# Altium project FD-JUL-MB.PrjPcb (part 1 of 3)
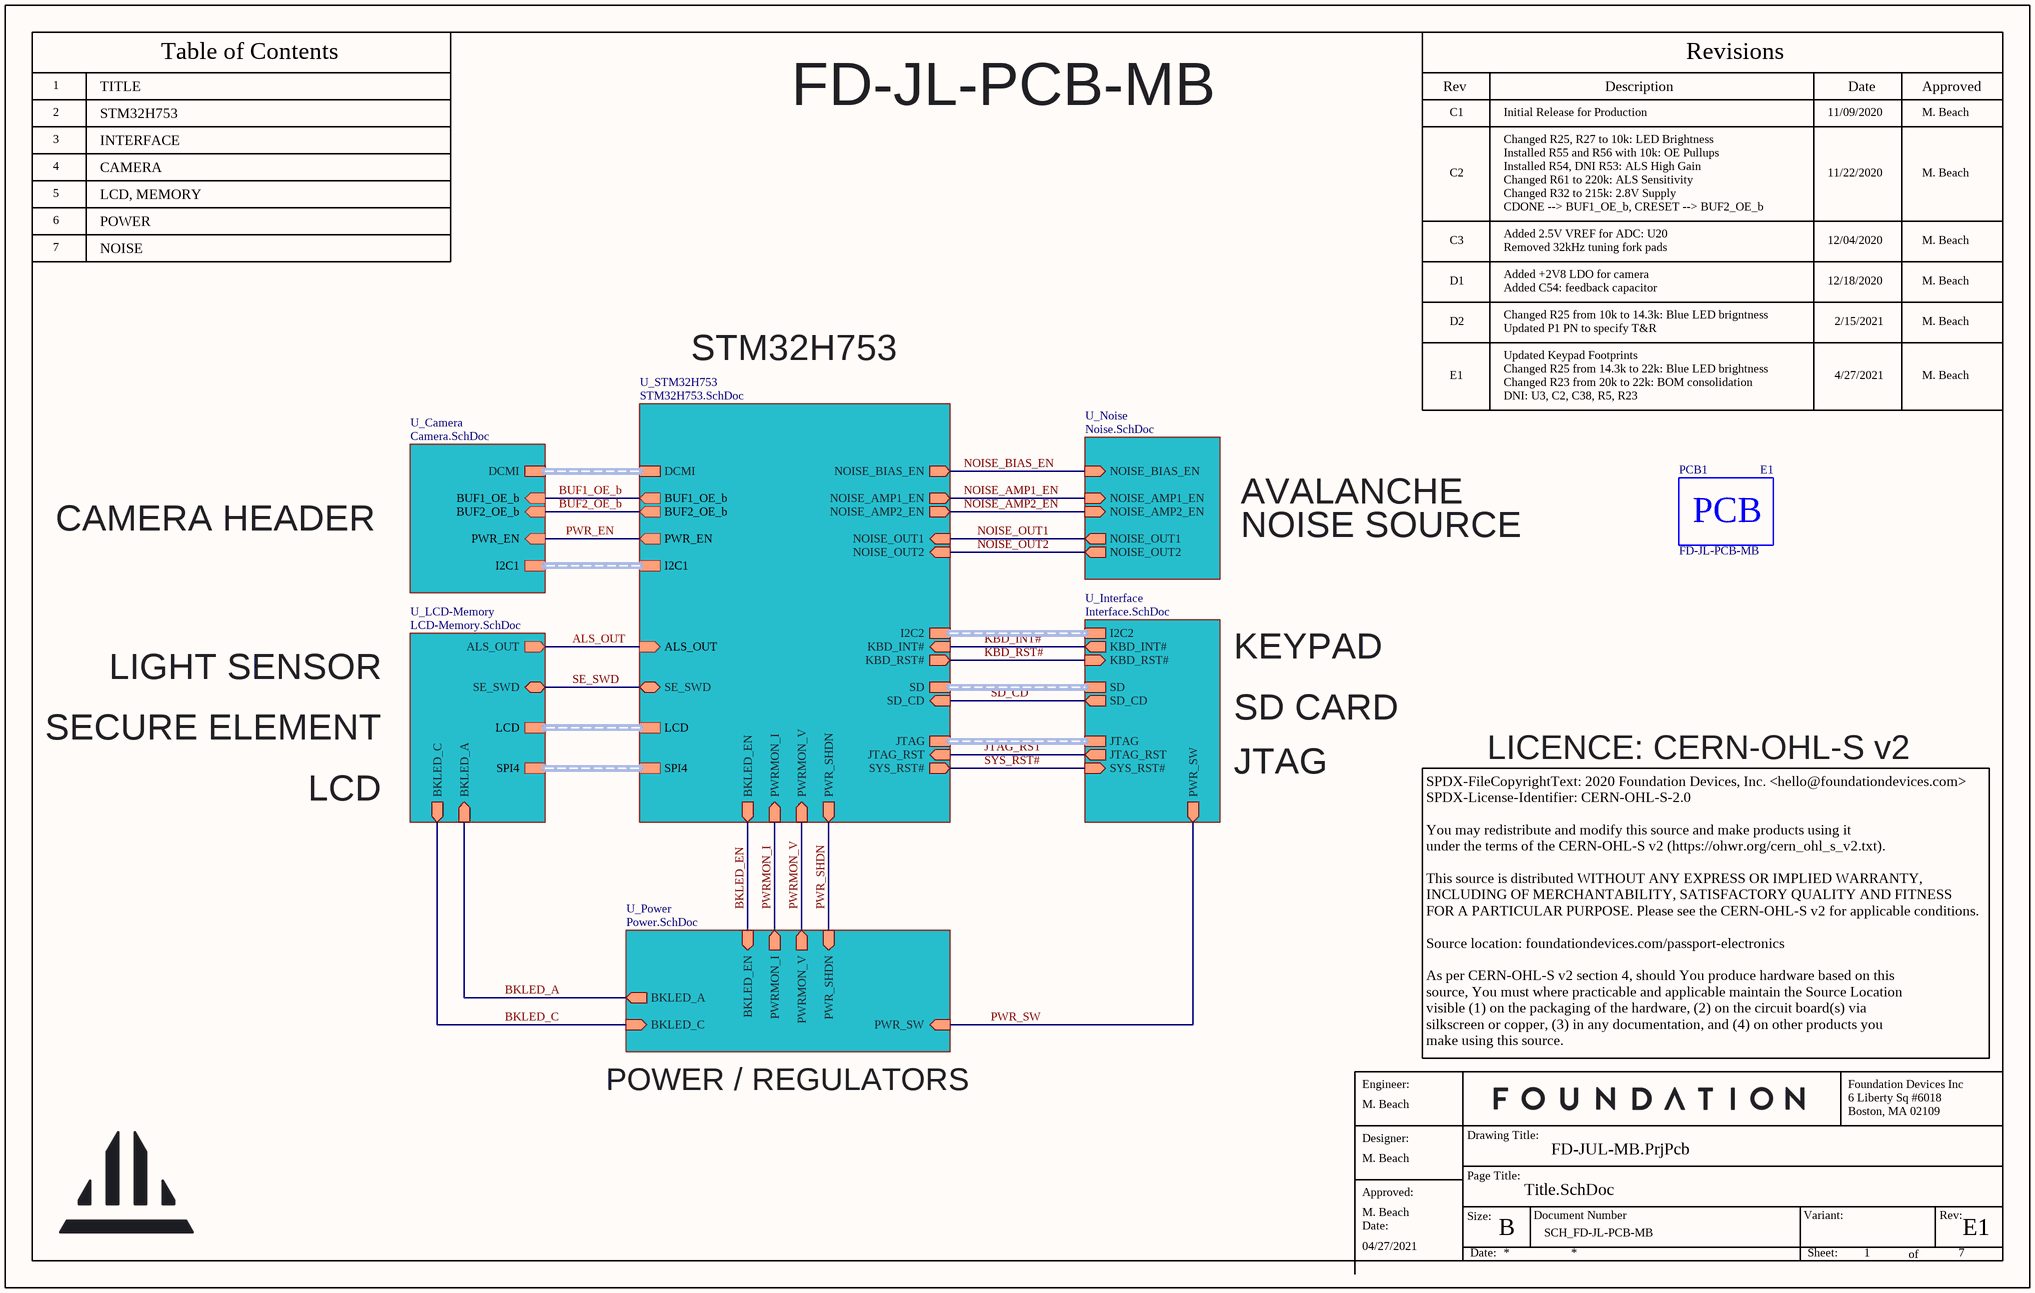
[diagram p0: Title.SchDoc]
SCH_REV: E1; PCB_REV: E1; PCB_PART_NUMBER: FD-JL-PCB-MB; PCB_ENGINEER_APP_DATE: 04/27/2021; PCB_ENGINEER: M. Beach; PCB_DWG_NO: PCB-DWG_FD-JL-PCB-MB; PCB_DESIGNER_APP_DATE: 04/27/2021; PCB_DESIGNER: M. Beach; PCB_CHECKER_APP_DATE: 04/27/2021; PCB_CHECKER: M. Beach; PCB_ASSEMBLY_NO: PCB-ASSY_FD-JL-PCB-MB; PCB_ANG_TOL: +/-1/2; PCB_3_DEC_TOL: +/-.010; PCB_2_DEC_TOL: +/-.01; NotFitted: NF; DOC_NO_SCH_DWG: SCH_FD-JL-PCB-MB; DOC_NO_FAB_DWG: FAB_FD-JL-PCB-MB; DOC_NO_BOM: BOM_FD-JL-PCBA-MB; DOC_NO_ASSY_DWG: ASSY_FD-JL-PCBA-MB
7 sheets, 215 parts. Net scope: hierarchical (ports join the sheet entries above them; power ports are global).
Board file: FD-JUL-MB_PCB.PcbDoc
Sheets:
  Title.SchDoc
    U_STM32H753 = STM32H753.SchDoc
    U_LCD-Memory = LCD-Memory.SchDoc
    U_Interface = Interface.SchDoc
    U_Power = Power.SchDoc
    U_Camera = Camera.SchDoc
    U_Noise = Noise.SchDoc

## Sheet Title.SchDoc
size B; DocumentNumber: 1; SheetNumber: 1; SheetTotal: 7; ENG_APP_DATE: --/--/--; DSN_APP_DATE: --/--/--; CHK_APP_DATE: --/--/--

### Parts
PCB1  FD-JL-PCB-MB  Rev: E1  (mechanical)

### Sub-sheets
U_Camera = Camera.SchDoc: DCMI (harness DCMI), BUF2_OE_b (in), PWR_EN (in), BUF1_OE_b (in), I2C1 (harness I2C)
U_Interface = Interface.SchDoc: I2C2 (harness I2C), KBD_INT# (out), SD (harness SD_Card), JTAG (harness JTAG), KBD_RST# (in), SD_CD (out), JTAG_RST (out), PWR_SW (out), SYS_RST# (in)
U_LCD-Memory = LCD-Memory.SchDoc: BKLED_A (in), BKLED_C (out), SE_SWD (bidir), ALS_OUT (out), LCD (harness LCD), SPI4 (harness SPI)
U_Noise = Noise.SchDoc: NOISE_OUT1 (out), NOISE_AMP2_EN (in), NOISE_BIAS_EN (in), NOISE_OUT2 (out), NOISE_AMP1_EN (in)
U_Power = Power.SchDoc: BKLED_A (out), BKLED_C (in), BKLED_EN (in), PWR_SHDN (in), PWR_SW (in), PWRMON_I (out), PWRMON_V (out)
U_STM32H753 = STM32H753.SchDoc: SD (harness SD_Card), KBD_INT# (in), I2C2 (harness I2C), JTAG (harness JTAG), DCMI (harness DCMI), KBD_RST# (out), SE_SWD (bidir), BKLED_EN (out), SD_CD (in), JTAG_RST (in), PWR_SHDN (out), SYS_RST# (out), NOISE_BIAS_EN (out), NOISE_AMP1_EN (out), NOISE_AMP2_EN (out), NOISE_OUT1 (in), NOISE_OUT2 (in), PWRMON_I (in), PWRMON_V (in), BUF2_OE_b (out), PWR_EN (out), BUF1_OE_b (out), LCD (harness LCD), I2C1 (harness I2C), SPI4 (harness SPI), ALS_OUT (in)

### Nets
ALS_OUT: sheet U_STM32H753/ALS_OUT, sheet U_LCD-Memory/ALS_OUT
BKLED_A: sheet U_LCD-Memory/BKLED_A, sheet U_Power/BKLED_A
BKLED_C: sheet U_LCD-Memory/BKLED_C, sheet U_Power/BKLED_C
BKLED_EN: sheet U_STM32H753/BKLED_EN, sheet U_Power/BKLED_EN
BUF1_OE_b: sheet U_STM32H753/BUF1_OE_b, sheet U_Camera/BUF1_OE_b
BUF2_OE_b: sheet U_STM32H753/BUF2_OE_b, sheet U_Camera/BUF2_OE_b
JTAG_RST: sheet U_STM32H753/JTAG_RST, sheet U_Interface/JTAG_RST
KBD_INT#: sheet U_STM32H753/KBD_INT#, sheet U_Interface/KBD_INT#
KBD_RST#: sheet U_STM32H753/KBD_RST#, sheet U_Interface/KBD_RST#
NOISE_AMP1_EN: sheet U_STM32H753/NOISE_AMP1_EN, sheet U_Noise/NOISE_AMP1_EN
NOISE_AMP2_EN: sheet U_STM32H753/NOISE_AMP2_EN, sheet U_Noise/NOISE_AMP2_EN
NOISE_BIAS_EN: sheet U_STM32H753/NOISE_BIAS_EN, sheet U_Noise/NOISE_BIAS_EN
NOISE_OUT1: sheet U_STM32H753/NOISE_OUT1, sheet U_Noise/NOISE_OUT1
NOISE_OUT2: sheet U_STM32H753/NOISE_OUT2, sheet U_Noise/NOISE_OUT2
PWR_EN: sheet U_STM32H753/PWR_EN, sheet U_Camera/PWR_EN
PWR_SHDN: sheet U_STM32H753/PWR_SHDN, sheet U_Power/PWR_SHDN
PWR_SW: sheet U_Interface/PWR_SW, sheet U_Power/PWR_SW
PWRMON_I: sheet U_STM32H753/PWRMON_I, sheet U_Power/PWRMON_I
PWRMON_V: sheet U_STM32H753/PWRMON_V, sheet U_Power/PWRMON_V
SD_CD: sheet U_STM32H753/SD_CD, sheet U_Interface/SD_CD
SE_SWD: sheet U_STM32H753/SE_SWD, sheet U_LCD-Memory/SE_SWD
SYS_RST#: sheet U_STM32H753/SYS_RST#, sheet U_Interface/SYS_RST#

### Buses and harness runs
harness sheet U_Camera/DCMI = sheet U_STM32H753/DCMI
harness sheet U_Camera/I2C1 = sheet U_STM32H753/I2C1
harness sheet U_Interface/I2C2 = sheet U_STM32H753/I2C2
harness sheet U_Interface/JTAG = sheet U_STM32H753/JTAG
harness sheet U_Interface/SD = sheet U_STM32H753/SD
harness sheet U_LCD-Memory/LCD = sheet U_STM32H753/LCD
harness sheet U_LCD-Memory/SPI4 = sheet U_STM32H753/SPI4

### Notes on the sheet
- TITLE
- 2
- 3
- STM32H753
- INTERFACE
- CAMERA
- FD-JL-PCB-MB
- C1
- Initial Release for Production
- Changed R25, R27 to 10k: LED Brightness
- Installed R55 and R56 with 10k: OE Pullups
- 11/09/2020
- M. Beach
- 4
- 5
- 6
- LCD, MEMORY
- POWER
- C2
- CDONE --> BUF1_OE_b, CRESET --> BUF2_OE_b
- Installed R54, DNI R53: ALS High Gain
- Changed R61 to 220k: ALS Sensitivity
- Changed R32 to 215k: 2.8V Supply
- Added 2.5V VREF for ADC: U20
- 11/22/2020
- 7
- NOISE
- C3
- D1
- Removed 32kHz tuning fork pads
- Added +2V8 LDO for camera
- Added C54: feedback capacitor
- 12/04/2020
- 12/18/2020
- D2
- Changed R25 from 10k to 14.3k: Blue LED brigntness
- Updated P1 PN to specify T&R
- Updated Keypad Footprints
- Changed R25 from 14.3k to 22k: Blue LED brightness
- 2/15/2021
- E1
- DNI: U3, C2, C38, R5, R23
- Changed R23 from 20k to 22k: BOM consolidation
- 4/27/2021
- AVALANCHE
- CAMERA HEADER
- NOISE SOURCE
- KEYPAD
- LIGHT SENSOR
- SD CARD
- SECURE ELEMENT
- JTAG
- LICENCE: CERN-OHL-S v2
- LCD
- POWER / REGULATORS
- SPDX-FileCopyrightText: 2020 Foundation Devices, Inc. <hello@foundationdevices.com>
  SPDX-License-Identifier: CERN-OHL-S-2.0
  You may redistribute and modify this source and make products using it
  under the terms of the CERN-OHL-S v2 (https://ohwr.org/cern_ohl_s_v2.txt).
  This source is distributed WITHOUT ANY EXPRESS OR IMPLIED WARRANTY,
  INCLUDING OF MERCHANTABILITY, SATISFACTORY QUALITY AND FITNESS
  FOR A PARTICULAR PURPOSE. Please see the CERN-OHL-S v2 for applicable conditions.
  Source location: foundationdevices.com/passport-electronics
  As per CERN-OHL-S v2 section 4, should You produce hardware based on this
  source, You must where practicable and applicable maintain the Source Location
  visible (1) on the packaging of the hardware, (2) on the circuit board(s) via
  silkscreen or copper, (3) in any documentation, and (4) on other products you
  make using this source.
- 1
- Table of Contents
- Rev
- Description
- Revisions
- Date
- Approved
- Engineer:
- Foundation Devices Inc
- 6 Liberty Sq #6018
- Designer:
- Drawing Title:
- Page Title:
- Boston, MA 02109
- Approved:
- Date:
- Size:
- B
- Document Number
- Variant:
- Rev:
- Sheet:
- of

### Library data of the parts
PCB1 = CMP-MISC-00002-5: PCB - Juliet - Main Board

## Sheet STM32H753.SchDoc
size B; DocumentNumber: 2; SheetNumber: 2; SheetTotal: 7; ENG_APP_DATE: --/--/--; DSN_APP_DATE: --/--/--; CHK_APP_DATE: --/--/--
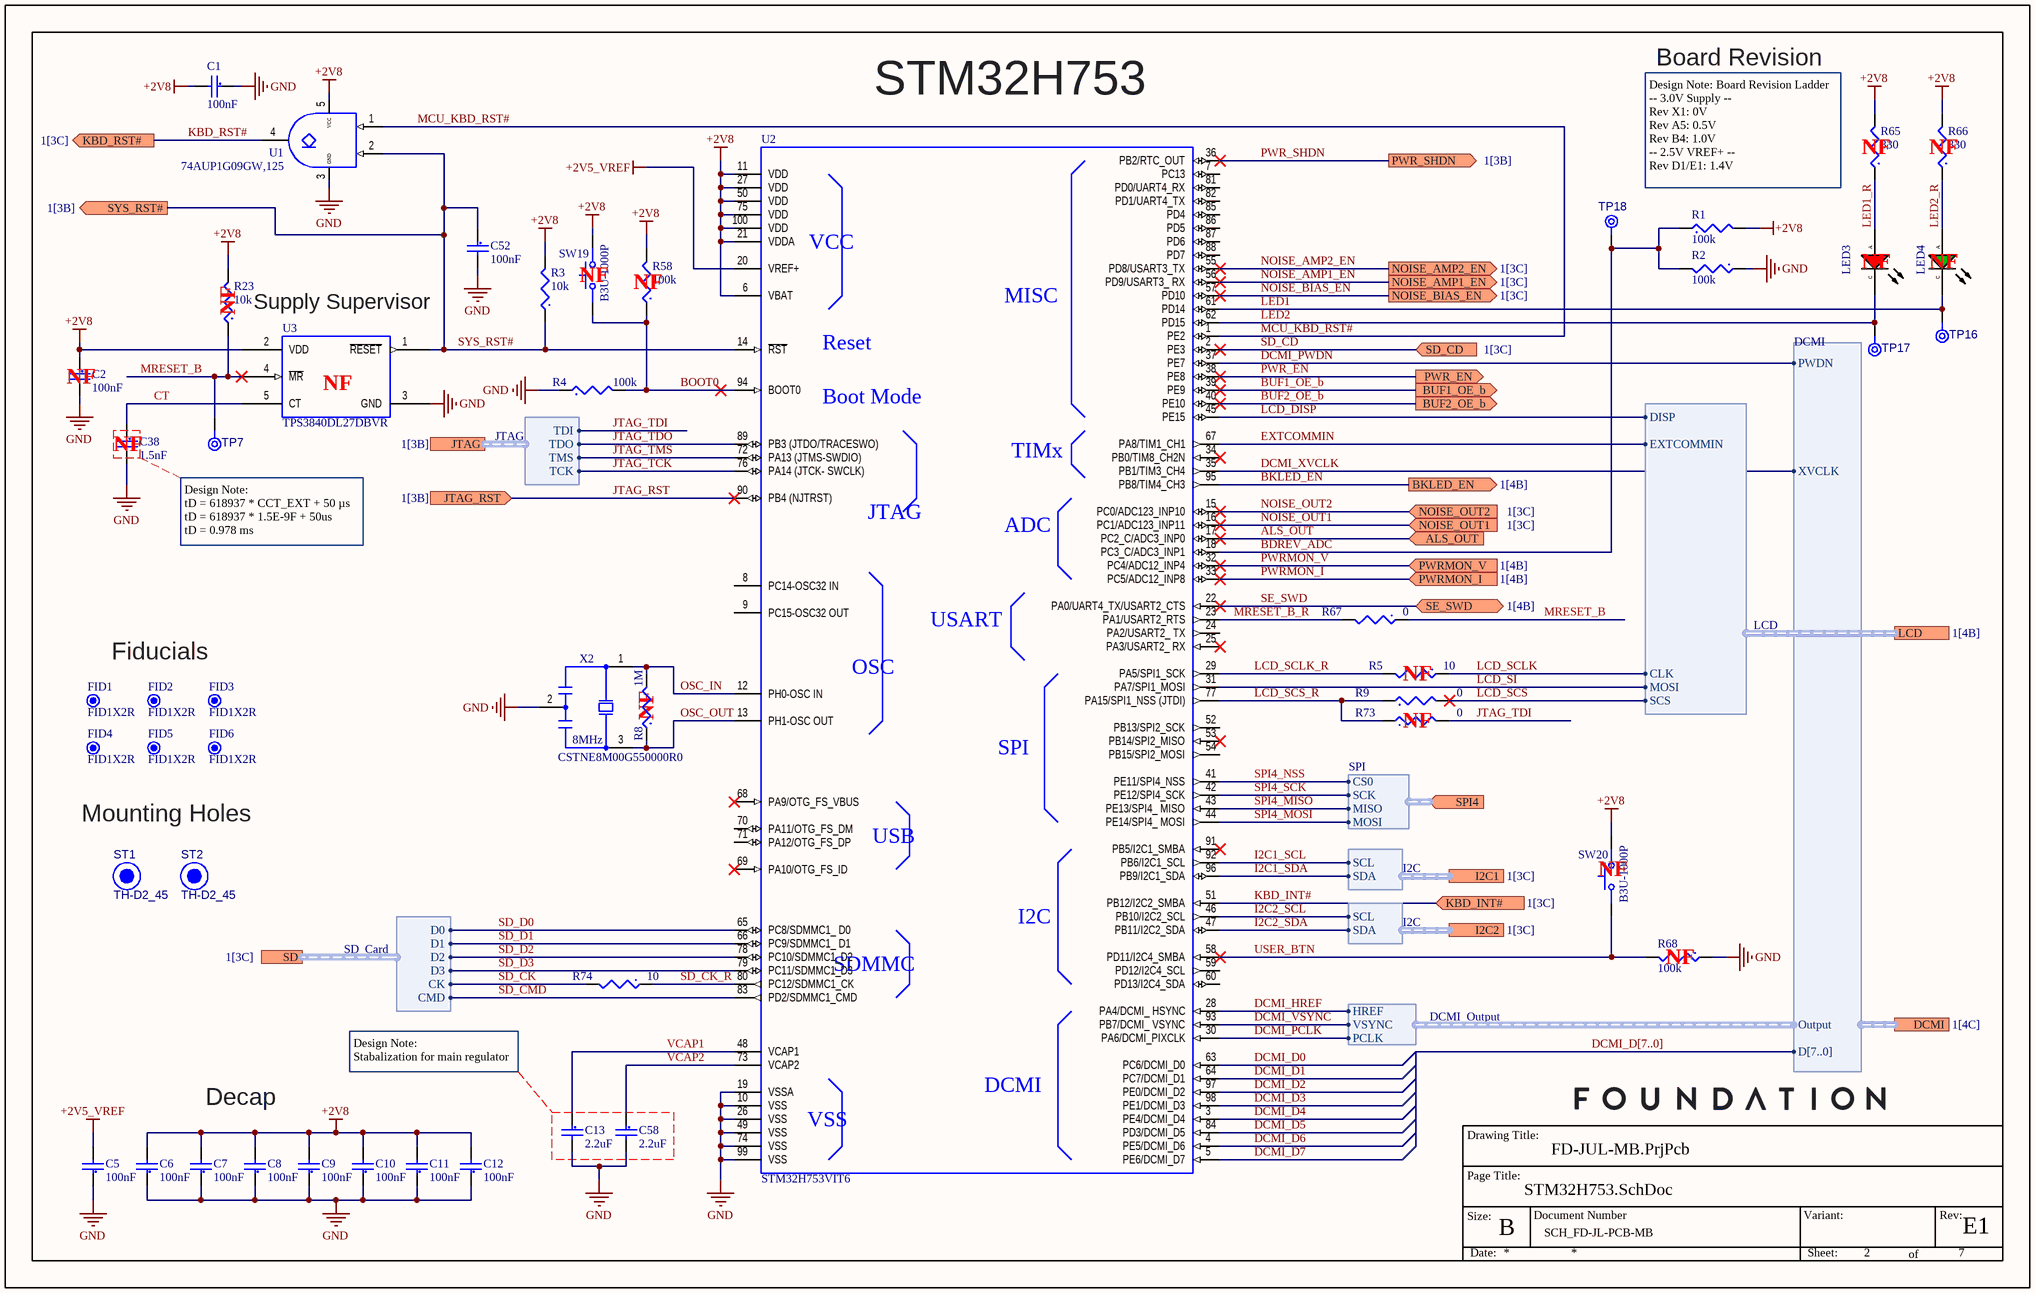
[diagram p1: STM32H753.SchDoc]

### Parts
C1  Capacitance: 100nF  [CAPC0402(1005)55_L]  (hidden comment: CAP CER 0.1uF 16V 10% X7R 0402)
C2  Capacitance: 100nF  [CAPC0402(1005)55_L]  (hidden comment: CAP CER 0.1uF 16V 10% X7R 0402)
C5  Capacitance: 100nF  [CAPC0402(1005)55_L]  (hidden comment: CAP CER 0.1uF 16V 10% X7R 0402)
C6  Capacitance: 100nF  [CAPC0402(1005)55_L]  (hidden comment: CAP CER 0.1uF 16V 10% X7R 0402)
C7  Capacitance: 100nF  [CAPC0402(1005)55_L]  (hidden comment: CAP CER 0.1uF 16V 10% X7R 0402)
C8  Capacitance: 100nF  [CAPC0402(1005)55_L]  (hidden comment: CAP CER 0.1uF 16V 10% X7R 0402)
C9  Capacitance: 100nF  [CAPC0402(1005)55_L]  (hidden comment: CAP CER 0.1uF 16V 10% X7R 0402)
C10  Capacitance: 100nF  [CAPC0402(1005)55_L]  (hidden comment: CAP CER 0.1uF 16V 10% X7R 0402)
C11  Capacitance: 100nF  [CAPC0402(1005)55_L]  (hidden comment: CAP CER 0.1uF 16V 10% X7R 0402)
C12  Capacitance: 100nF  [CAPC0402(1005)55_L]  (hidden comment: CAP CER 0.1uF 16V 10% X7R 0402)
C13  Capacitance: 2.2uF  [CAPC0402(1005)55_L]  (hidden comment: CAP CER 2.2uF 6.3V 10% X5R 0402)
C38  Capacitance: 1.5nF  [CAPC0402(1005)55_L]  (hidden comment: CAP CER 1500pF 50V 10% X7R 0402)
C52  Capacitance: 100nF  [CAPC0402(1005)55_L]  (hidden comment: CAP CER 0.1uF 16V 10% X7R 0402)
C58  Capacitance: 2.2uF  [CAPC0402(1005)55_L]  (hidden comment: CAP CER 2.2uF 6.3V 10% X5R 0402)
FID1  FID1X2R  [FID1X2R]  (no BOM)
FID2  FID1X2R  [FID1X2R]  (no BOM)
FID3  FID1X2R  [FID1X2R]  (no BOM)
FID4  FID1X2R  [FID1X2R]  (no BOM)
FID5  FID1X2R  [FID1X2R]  (no BOM)
FID6  FID1X2R  [FID1X2R]  (no BOM)
LED3  LTST-C191KRKT  [LEDC0603(1608)65_L]  (value not drawn)
LED4  LTST-C191KGKT  [LEDC0603(1608)65_L]  (value not drawn)
R1  Resistance: 100k  [RESC0402(1005)_L]  (hidden comment: RES 100K 1/16W 1% 0402)
R2  Resistance: 100k  [RESC0402(1005)_L]  (hidden comment: RES 100K 1/16W 1% 0402)
R3  Resistance: 10k  [RESC0402(1005)_L]  (hidden comment: RES 10K 1/16W 1% 0402)
R4  Resistance: 100k  [RESC0402(1005)_L]  (hidden comment: RES 100K 1/16W 1% 0402)
R5  Resistance: 10  [RESC0402(1005)_L]  (hidden comment: RES 10 OHM 1/16W 1% 0402)
R8  Resistance: 1M  [RESC0402(1005)_L]  (hidden comment: RES 1M 1/16W 1% 0402)
R9  Resistance: 0  [RESC0402(1005)_L]  (hidden comment: RES 0 OHM JUMPER 1/16W 0402)
R23  Resistance: 10k  [RESC0402(1005)_L]  (hidden comment: RES 10K 1/16W 1% 0402)
R58  Resistance: 100k  [RESC0402(1005)_L]  (hidden comment: RES 100K 1/16W 1% 0402)
R65  Resistance: 330  [RESC0402(1005)_L]  (hidden comment: RES 330 OHM 1/16W 1% 0402)
R66  Resistance: 330  [RESC0402(1005)_L]  (hidden comment: RES 330 OHM 1/16W 1% 0402)
R67  Resistance: 0  [RESC0402(1005)_L]  (hidden comment: RES 0 OHM JUMPER 1/16W 0402)
R68  Resistance: 100k  [RESC0402(1005)_L]  (hidden comment: RES 100K 1/16W 1% 0402)
R73  Resistance: 0  [RESC0402(1005)_L]  (hidden comment: RES 0 OHM JUMPER 1/16W 0402)
R74  Resistance: 10  [RESC0402(1005)_L]  (hidden comment: RES 10 OHM 1/16W 1% 0402)
ST1  TH-D2_45  [TH-D2_54]  (no BOM)
ST2  TH-D2_45  [TH-D2_54]  (no BOM)
SW19  B3U-1000P  [OMRON-B3U-1000P-2_V]
SW20  B3U-1000P  [OMRON-B3U-1000P-2_V]
TP7  TPAD8R  [TP08R]  (value not drawn)  (no BOM)
TP16  TPAD8R  [TP08R]  (value not drawn)  (no BOM)
TP17  TPAD8R  [TP08R]  (value not drawn)  (no BOM)
TP18  TPAD8R  [TP08R]  (value not drawn)  (no BOM)
U1  74AUP1G09GW,125  [NEXP - TSSOP-5_L]
U2  STM32H753VIT6  [STM - LQFP-100_L]
U3  TPS3840DL27DBVR  [SOT-23-5(95)_L]
X2  CSTNE8M00G550000R0  Frequency: 8MHz  [MURA - CSTNE_V]

### Ports
ALS_OUT (in), BKLED_EN (out, see 1[4B]), BUF1_OE_b (out), BUF2_OE_b (out), DCMI (harness DCMI, see 1[4C]), I2C1 (harness I2C, see 1[3C]), I2C2 (harness I2C, see 1[3C]), JTAG (harness JTAG, see 1[3B]), JTAG_RST (in, see 1[3B]), KBD_INT# (in, see 1[3C]), KBD_RST# (out, see 1[3C]), LCD (harness LCD, see 1[4B]), NOISE_AMP1_EN (out, see 1[3C]), NOISE_AMP2_EN (out, see 1[3C]), NOISE_BIAS_EN (out, see 1[3C]), NOISE_OUT1 (in, see 1[3C]), NOISE_OUT2 (in, see 1[3C]), PWR_EN (out), PWR_SHDN (out, see 1[3B]), PWRMON_I (in, see 1[4B]), PWRMON_V (in, see 1[4B]), SD (harness SD_Card, see 1[3C]), SD_CD (in, see 1[3C]), SE_SWD (bidir, see 1[4B]), SPI4 (in, harness SPI), SYS_RST# (out, see 1[3B])

### Harnesses
LCD: CLK, SCS, MOSI, DISP, EXTCOMMIN
I2C: SCL, SDA
DCMI: Output, D[7..0], PWDN, XVCLK
DCMI_Output: HREF, PCLK, VSYNC
JTAG: TCK, TDI, TDO, TMS
SD_Card: CK, CMD, D0, D1, D2, D3
SPI: CS0, MISO, MOSI, SCK

### Nets
+2V5_VREF: C5.2 U2.20(VREF+)
+2V8: C1.2 C2.1 C6.2 C7.2 C8.2 C9.2 C10.2 C11.2 C12.2 R1.2 R3.2 R23.2 R58.2 R65.2 R66.2 SW19.2 SW20.2 U1.5(VCC) U2.6(VBAT) U2.11(VDD) U2.21(VDDA) U2.27(VDD) U2.50(VDD) U2.75(VDD) U2.100(VDD) U3.2(VDD)
GND: C1.1 C2.2 C5.1 C6.1 C7.1 C8.1 C9.1 C10.1 C11.1 C12.1 C13.2 C38.2 C52.2 C58.2 R2.1 R4.1 R68.1 U1.3(GND) U2.10(VSS) U2.19(VSSA) U2.26(VSS) U2.49(VSS) U2.74(VSS) U2.99(VSS) U3.3(GND) X2.2(GND)
ALS_OUT: U2.17(PC2_C/ADC3_INP0) ; port ALS_OUT
BDREV_ADC: R1.1 R2.2 TP18.1(TP) U2.18(PC3_C/ADC3_INP1)
BKLED_EN: U2.95(PB8/TIM4_CH3) ; port BKLED_EN
BOOT0: R4.2 R58.1 SW19.1 U2.94(BOOT0)
BUF1_OE_b: U2.39(PE9) ; port BUF1_OE_b
BUF2_OE_b: U2.40(PE10) ; port BUF2_OE_b
CT: C38.1 U3.5(CT)
DCMI_D0: U2.63(PC6/DCMI_D0)
DCMI_D1: U2.64(PC7/DCMI_D1)
DCMI_D2: U2.97(PE0/DCMI_D2)
DCMI_D3: U2.98(PE1/DCMI_D3)
DCMI_D4: U2.3(PE4/DCMI_D4)
DCMI_D5: U2.84(PD3/DCMI_D5)
DCMI_D6: U2.4(PE5/DCMI_D6)
DCMI_D7: U2.5(PE6/DCMI_D7)
DCMI_HREF: U2.28(PA4/DCMI__HSYNC) ; harness DCMI_Output.HREF
DCMI_PCLK: U2.30(PA6/DCMI_PIXCLK) ; harness DCMI_Output.PCLK
DCMI_PWDN: U2.37(PE7) ; port DCMI.PWDN
DCMI_VSYNC: U2.93(PB7/DCMI__VSYNC) ; harness DCMI_Output.VSYNC
DCMI_XVCLK: U2.35(PB1/TIM3_CH4) ; port DCMI.XVCLK
EXTCOMMIN: U2.67(PA8/TIM1_CH1) ; port LCD.EXTCOMMIN
I2C1_SCL: U2.92(PB6/I2C1_SCL) ; port I2C1.SCL
I2C1_SDA: U2.96(PB9/I2C1_SDA) ; port I2C1.SDA
I2C2_SCL: U2.46(PB10/I2C2_SCL) ; port I2C2.SCL
I2C2_SDA: U2.47(PB11/I2C2_SDA) ; port I2C2.SDA
JTAG_RST: U2.90(PB4_(NJTRST)) ; port JTAG_RST
JTAG_TCK: U2.76(PA14_(JTCK-_SWCLK)) ; port JTAG.TCK
JTAG_TDI: R73.2 ; port JTAG.TDI
JTAG_TDO: U2.89(PB3_(JTDO/TRACESWO)) ; port JTAG.TDO
JTAG_TMS: U2.72(PA13_(JTMS-SWDIO)) ; port JTAG.TMS
KBD_INT#: U2.51(PB12/I2C2_SMBA) ; port KBD_INT#
KBD_RST#: U1.4 ; port KBD_RST#
LCD_DISP: U2.45(PE15) ; port LCD.DISP
LCD_SCLK: R5.1 ; port LCD.CLK
LCD_SCLK_R: R5.2 U2.29(PA5/SPI1_SCK)
LCD_SCS: R9.2 ; port LCD.SCS
LCD_SCS_R: R9.1 R73.1 U2.77(PA15/SPI1_NSS_(JTDI))
LCD_SI: U2.31(PA7/SPI1_MOSI) ; port LCD.MOSI
LED1: LED4.C TP16.1(TP) U2.61(PD14)
LED1_R: LED3.A R65.1
LED2: LED3.C TP17.1(TP) U2.62(PD15)
LED2_R: LED4.A R66.1
MCU_KBD_RST#: U1.1 U2.1(PE2)
MRESET_B: R23.1 R67.1 TP7.1(TP) U3.4(~{MR})
MRESET_B_R: R67.2 U2.23(PA1/USART2_RTS)
NOISE_AMP1_EN: U2.56(PD9/USART3__RX) ; port NOISE_AMP1_EN
NOISE_AMP2_EN: U2.55(PD8/USART3_TX) ; port NOISE_AMP2_EN
NOISE_BIAS_EN: U2.57(PD10) ; port NOISE_BIAS_EN
NOISE_OUT1: U2.16(PC1/ADC123_INP11) ; port NOISE_OUT1
NOISE_OUT2: U2.15(PC0/ADC123_INP10) ; port NOISE_OUT2
OSC_IN: R8.2 U2.12(PH0-OSC_IN) X2.1
OSC_OUT: R8.1 U2.13(PH1-OSC_OUT) X2.3
PWR_EN: U2.38(PE8) ; port PWR_EN
PWR_SHDN: U2.36(PB2/RTC_OUT) ; port PWR_SHDN
PWRMON_I: U2.33(PC5/ADC12_INP8) ; port PWRMON_I
PWRMON_V: U2.32(PC4/ADC12_INP4) ; port PWRMON_V
SD_CD: U2.2(PE3) ; port SD_CD
SD_CK: R74.2 ; port SD.CK
SD_CK_R: R74.1 U2.80(PC12/SDMMC1_CK)
SD_CMD: U2.83(PD2/SDMMC1_CMD) ; port SD.CMD
SD_D0: U2.65(PC8/SDMMC1__D0) ; port SD.D0
SD_D1: U2.66(PC9/SDMMC1__D1) ; port SD.D1
SD_D2: U2.78(PC10/SDMMC1_D2) ; port SD.D2
SD_D3: U2.79(PC11/SDMMC1_D3) ; port SD.D3
SE_SWD: U2.22(PA0/UART4_TX/USART2_CTS) ; port SE_SWD
SPI4_MISO: U2.43(PE13/SPI4__MISO) ; port SPI4.MISO
SPI4_MOSI: U2.44(PE14/SPI4__MOSI) ; port SPI4.MOSI
SPI4_NSS: U2.41(PE11/SPI4_NSS) ; port SPI4.CS0
SPI4_SCK: U2.42(PE12/SPI4_SCK) ; port SPI4.SCK
SYS_RST#: C52.1 R3.1 U1.2 U2.14(~{RST}) U3.1(~{RESET}) ; port SYS_RST#
USER_BTN: R68.2 SW20.1 U2.58(PD11/I2C4_SMBA)
VCAP1: C13.1 U2.48(VCAP1)
VCAP2: C58.1 U2.73(VCAP2)

Not connected (* = marked no-connect by the designer): U2 7(PC13) 8(PC14-OSC32_IN) 9(PC15-OSC32_OUT) 24(PA2/USART2__TX) 25(PA3/USART2__RX)* 34(PB0/TIM8_CH2N)* 52(PB13/SPI2_SCK) 53(PB14/SPI2_MISO)* 54(PB15/SPI2_MOSI) 59(PD12/I2C4_SCL) 60(PD13/I2C4_SDA) 68(PA9/OTG_FS_VBUS)* 69(PA10/OTG_FS_ID)* 70(PA11/OTG_FS_DM) 71(PA12/OTG_FS_DP) 81(PD0/UART4_RX) 82(PD1/UART4_TX) 85(PD4) 86(PD5) 87(PD6) 88(PD7) 91(PB5/I2C1_SMBA)*

### Buses and harness runs
bus DCMI_D[7..0]

### Notes on the sheet
- STM32H753
- Board Revision
- Design Note: Board Revision Ladder
  -- 3.0V Supply --
  Rev X1: 0V
  Rev A5: 0.5V
  Rev B4: 1.0V
  -- 2.5V VREF+ --
  Rev D1/E1: 1.4V
- Supply Supervisor
- Design Note:
  tD = 618937 * CCT_EXT + 50 µs
  tD = 618937 * 1.5E-9F + 50us
  tD = 0.978 ms
- Fiducials
- Mounting Holes
- Decap
- Design Note:
  Stabalization for main regulator
- Drawing Title:
- Page Title:
- Size:
- B
- Document Number
- Variant:
- Rev:
- Date:
- Sheet:
- of
- (in symbol CMP-IC-CPU-00008-1) VCC; MISC; Reset; Boot Mode; TIMx; JTAG; ADC; USART; OSC; SPI; USB; I2C; SDMMC; DCMI

### Library data of the parts
C1 C2 C5-C12 C52 = CMP-CAP-00002-2: 0.1µF ±10% 16V Ceramic Capacitor X7R 0402 (1005 Metric); Insulation Resistance: 10GR; Material: Ceramic; Tolerance: 10%; REACH SVHC: No SVHC; Radiation Hardening: No; Case Code (Metric): 1005; Height: 0.5mm; Depth: 0.5mm; Min Operating Temperature: -55°C; Max Operating Temperature: 125°C; Lead Free: Lead Free; Thickness: 0.022inch; Length: 1mm; Voltage Rating (DC): 16V; Dielectric Material: Ceramic; Packaging: Tape and Reel; Case/Package: 0402; Width: 0.5mm; Termination: SMD/SMT; Voltage Rating: 16V; Mount: Surface Mount; Case Code (Imperial): 0402; Package Quantity: 1; Dielectric: X7R; Number of Pins: 2; Voltage: 16V
C13 C58 = CMP-CAP-00042-1: 2.2µF ±10% 6.3V Ceramic Capacitor X5R 0402 (1005 Metric); Lead Free: Lead Free; Tolerance: 10%; Width: 0.02inch; Number of Pins: 2; Contact Plating: Tin,Matte; Max Operating Temperature: 85°C; Termination: SMD/SMT; Voltage Rating: 6.3V; Thickness: 0.022inch; Case Code (Imperial): 0402; Case Code (Metric): 1005; Radiation Hardening: No; Package Quantity: 1; Mount: Surface Mount; Length: 1mm; Case/Package: 0402; REACH SVHC: No SVHC; Packaging: Tape and Reel; Min Operating Temperature: -55°C; Dielectric: X5R; Depth: 0.5mm; Voltage Rating (DC): 6.3V
C38 = CMP-CAP-00034-1: 1500pF ±10% 50V Ceramic Capacitor X7R 0402 (1005 Metric); Case/Package: 0402; Thickness: 0.022inch; Max Operating Temperature: 125°C; Package Quantity: 1; Contact Plating: Tin; Dielectric: X7R; Min Operating Temperature: -55°C; Voltage: 50V; Case Code (Metric): 1005; Length: 1mm; Packaging: Tape and Reel; Width: 0.02inch; Depth: 0.5mm; Voltage Rating: 50V; Material: Ceramic; Tolerance: 10%; Case Code (Imperial): 0402; Radiation Hardening: No; Height: 0.5mm; Mount: Surface Mount
FID1-FID6 = CMP-MECH-00000-3: Fiducial - Round 1x2mm; Pins: 0
LED3 = CMP-007-00039-8: Red 631nm LED Indication - Discrete 2V 0603 (1608 Metric); Number of Elements: 1; Viewing Angle: 130°; Wavelength: 639nm; Lens Transparency: Clear; Lens Style: Clear,Diffused,Colorless,Rectangular; Forward Current: 30mA; Reverse Voltage: 5V; Power Dissipation: 75mW; Luminous Intensity: 54mcd; Test Current: 20mA; Lens Color: Colorless; Dominant Wavelength: 631nm; Case Code (Metric): 1608; Max Operating Temperature: 85°C; Radiation Hardening: No; Mount: Surface Mount; Depth: 0.8mm; Color: Red; Case/Package: 0603; Number of Pins: 2; Voltage: 2V; Length: 1.6mm; Forward Voltage: 2V; Number of LEDs: 1; Case Code (Imperial): 0603; Width: 0.8mm; Illumination Color: Red; Package Quantity: 1; Height: 0.55mm; Lead Free: Lead Free; Power Rating: 75mW; Packaging: Tape and Reel; Min Operating Temperature: -55°C
LED4 = CMP-007-00037-8: Green 571nm LED Indication - Discrete 2V 0603 (1608 Metric); Lens Color: Colorless; Wavelength: 574nm; Viewing Angle: 130°; Test Current: 20mA; Forward Current: 30mA; Power Rating: 75mW; Number of LEDs: 1; Lens Style: Rectangular,Colorless; Reverse Voltage: 5V; Luminous Intensity: 35mcd; Lens Transparency: Clear; Length: 1.6mm; Width: 0.8mm; Forward Voltage: 2V; Lead Free: Lead Free; Depth: 0.8mm; Max Operating Temperature: 85°C; Mount: Surface Mount; Case Code (Imperial): 0603; Power Dissipation: 75mW; Height: 0.55mm; Case Code (Metric): 1608; Color: Green; Max Power Dissipation: 75mW; Package Quantity: 1; Number of Elements: 1; Number of Pins: 2; Dominant Wavelength: 571nm; Case/Package: 0603; Min Operating Temperature: -55°C; Packaging: Tape and Reel; Illumination Color: Green; Radiation Hardening: No
R1 = CMP-RES-00003-3: 100 kOhms ±1% 0.063W, 1/16W Chip Resistor 0402 (1005 Metric) Automotive AEC-Q200 Thick Film; Power Rating: 63mW; Voltage Rating (DC): 50V; Temperature Coefficient: 100ppm/°C; Military Standard: Not; Case Code (Metric): 1005; Case Code (Imperial): 0402; Min Operating Temperature: -55°C; Length: 1mm; Weight: 2.3E-05oz; Width: 0.02inch; Number of Terminations: 2; Radiation Hardening: No; REACH SVHC: Unknown; Tolerance: 1%; Package Quantity: 10000; Lead Free: Lead Free; Max Power Dissipation: 63mW; Features: Automotive AEC-Q200; Height: 0.35mm; Composition: Thick Film; Max Operating Temperature: 155°C; Contact Plating: Tin; Depth: 0.5mm; Voltage Rating: 50V; Packaging: Tape and Reel; Case/Package: 0402; Termination: SMD/SMT; Mount: Surface Mount; Number of Pins: 2
R2 = CMP-RES-00003-3: 100 kOhms ±1% 0.063W, 1/16W Chip Resistor 0402 (1005 Metric) Automotive AEC-Q200 Thick Film; Voltage Rating (DC): 50V; Power Rating: 63mW; Temperature Coefficient: 100ppm/°C; Case Code (Imperial): 0402; Composition: Thick Film; Features: Automotive AEC-Q200; Depth: 0.5mm; Height: 0.35mm; Weight: 2.3E-05oz; Termination: SMD/SMT; Min Operating Temperature: -55°C; Length: 1mm; Package Quantity: 10000; Lead Free: Lead Free; Radiation Hardening: No; Max Operating Temperature: 155°C; Voltage Rating: 50V; Military Standard: Not; Case/Package: 0402; Contact Plating: Tin; Max Power Dissipation: 63mW; Tolerance: 1%; Case Code (Metric): 1005; Number of Terminations: 2; Packaging: Tape and Reel; REACH SVHC: Unknown; Width: 0.02inch; Mount: Surface Mount; Number of Pins: 2
R3 R23 = CMP-RES-00006-3: 10 kOhms ±1% 0.063W, 1/16W Chip Resistor 0402 (1005 Metric); Voltage Rating (DC): 50V; Power Rating: 63mW; Temperature Coefficient: 100ppm/°C; Case Code (Imperial): 0402; Mount: Surface Mount; Composition: Thick Film; Features: Automotive AEC-Q200; Depth: 0.5mm; Height: 0.35mm; Weight: 2.3E-05oz; Number of Pins: 2; Termination: SMD/SMT; Min Operating Temperature: -55°C; Length: 1mm; Package Quantity: 10; Lead Free: Lead Free; Radiation Hardening: No; Max Operating Temperature: 155°C; Voltage Rating: 50V; Military Standard: Not; Case/Package: 0402; Contact Plating: Tin; Max Power Dissipation: 63mW; Tolerance: 1%; Case Code (Metric): 1005; Number of Terminations: 2; Packaging: Tape and Reel; REACH SVHC: Unknown; Width: 0.02inch
R4 R58 R68 = CMP-RES-00003-3: 100 kOhms ±1% 0.063W, 1/16W Chip Resistor 0402 (1005 Metric) Automotive AEC-Q200 Thick Film; Max Power Dissipation: 63mW; Voltage Rating: 50V; Temperature Coefficient: 100ppm/°C; Max Operating Temperature: 155°C; Weight: 2.3E-05oz; Packaging: Tape and Reel; REACH SVHC: Unknown; Length: 1mm; Features: Automotive AEC-Q200; Depth: 0.5mm; Composition: Thick Film; Case Code (Imperial): 0402; Number of Terminations: 2; Package Quantity: 10000; Min Operating Temperature: -55°C; Number of Pins: 2; Lead Free: Lead Free; Military Standard: Not; Case/Package: 0402; Contact Plating: Tin; Tolerance: 1%; Radiation Hardening: No; Termination: SMD/SMT; Voltage Rating (DC): 50V; Mount: Surface Mount; Power Rating: 63mW; Case Code (Metric): 1005; Width: 0.02inch; Height: 0.35mm
R5 R74 = CMP-RES-00018-3: 10 Ohms ±1% 0.063W, 1/16W Chip Resistor 0402 (1005 Metric); Temperature Coefficient: 100ppm/°C; Working Voltage: 50V; Power Rating: 63mW; REACH SVHC: Unknown; Composition: Thick Film; Case/Package: 0402; Tolerance: 1%; Number of Terminations: 2; Military Standard: Not; Case Code (Imperial): 0402; Max Operating Temperature: 155°C; Case Code (Metric): 1005; Packaging: Tape and Reel; Lead Free: Lead Free; Depth: 0.5mm; Termination: SMD/SMT; Length: 1mm; Voltage Rating: 50V; Height: 0.32mm; Min Operating Temperature: -55°C
R8 = CMP-RES-00010-3: 1 MOhms ±1% 0.063W, 1/16W Chip Resistor 0402 (1005 Metric); Temperature Coefficient: 100ppm/°C; Max Power Dissipation: 63mW; Voltage Rating: 250V; Power Rating: 62.5mW; Tolerance: 1%; Width: 0.02inch; Number of Terminations: 2; Composition: Thick Film; Radiation Hardening: No; Case Code (Imperial): 0402; Depth: 0.5mm; Packaging: Tape and Reel; Length: 1mm; Min Operating Temperature: -55°C; Contact Plating: Tin,Matte; Features: Automotive AEC-Q200; Max Operating Temperature: 155°C; Mount: Surface Mount; Case Code (Metric): 1005; Case/Package: 0402; Height: 0.016inch; Lead Free: Lead Free; Military Standard: Not
R9 R67 R73 = CMP-RES-00014-4: 0 Ohms Jumper 0.063W, 1/16W Chip Resistor 0402 (1005 Metric); Temperature Coefficient: 200ppm/°C; Power Rating: 62.5mW; Max Power Dissipation: 63mW; Tolerance: 5%; Voltage Rating: 50V; Lead Free: Lead Free; Height: 0.016inch; Military Standard: Not; Max Operating Temperature: 155°C; Features: Moisture Resistant; Case/Package: 0402; Contact Plating: Tin,Matte; Composition: Thick Film; Number of Terminations: 2; Case Code (Imperial): 0402; Package Quantity: 1; REACH SVHC: Unknown; Radiation Hardening: No; Case Code (Metric): 1005; Width: 0.02inch; Termination: SMD/SMT; Min Operating Temperature: -55°C; Length: 1mm; Packaging: Tape and Reel; Depth: 0.5mm
R65 R66 = CMP-RES-00009-3: 330 Ohms ±1% 0.063W, 1/16W Chip Resistor 0402 (1005 Metric) Moisture Resistant Thick Film; Voltage Rating (DC): 50V; Temperature Coefficient: 100ppm/°C; Power Rating: 63mW; Composition: Thick Film; Weight: 2.3E-05oz; Length: 1mm; Min Operating Temperature: -55°C; Depth: 0.5mm; Packaging: Tape and Reel; Termination: SMD/SMT; Width: 0.5mm; Case Code (Metric): 1005; Case/Package: 0402; Military Standard: Not; Tolerance: 1%; Height: 0.35mm; Number of Terminations: 2; Lead Free: Lead Free; Case Code (Imperial): 0402; Max Operating Temperature: 155°C; Features: Automotive AEC-Q200; Voltage Rating: 50V; Package Quantity: 10; Max Power Dissipation: 63mW; REACH SVHC: Unknown; Radiation Hardening: No; Contact Plating: Tin
ST1 ST2 = CMP-MECH-00006-1: Through Hole, Drill 2.54mm
SW19 SW20 = CMP-SWH-0000-2: Tactile Switch SPST-NO Top Actuated Surface Mount; Electrical Life: 200000Cycles; Contact Current Rating: 50mA; Switch Travel: 0.15mm; Ratings: Dust Proof,IP40; Max Voltage Rating (DC): 12V; Actuator Type: Standard; Contact Resistance: 100mR; Illumination Type: Non-Illuminated,Illuminated; Switch Function: Off-Mom; Throw Configuration: SPST; Actuator Length: 0.4mm; Operating Force: 1.5N; Lead Free: Lead Free; Packaging: Tape and Reel; Mount: Surface Mount; Length: 4mm; Package Quantity: 1; Weight: 0.000776oz; Max Operating Temperature: 70°C; REACH SVHC: Unknown; Mechanical Life: 200000Cycles; Contact Material: Silver; Max Current Rating: 50mA; Orientation: Straight; ComponentLink1URL: https://omronfs.omron.com/en_US/ecb/products/pdf/en-b3u.pdf; Insulation Resistance: 100MR; Termination: SMD/SMT; ComponentLink1Description: Datasheet; Voltage Rating (DC): 12V; Width: 3mm; Min Operating Temperature: -25°C; Depth: 2.5mm; Height: 1.2mm; Current Rating: 50mA
TP7 TP16-TP18 = CMP-MECH-00011-2: 0.8mm round; Pins: 1
U1 = CMP-IC-LOG-0000-3: IC GATE AND 1CH 2-INP 5TSSOP; Max Supply Voltage: 3.6V; Min Supply Voltage: 800mV; Min Operating Temperature: -40°C; ComponentLink1URL: https://assets.nexperia.com/documents/data-sheet/74AUP1G09.pdf; ComponentLink1Description: Datasheet; Max Operating Temperature: 125°C; Case/Package: TSSOP
U2 = CMP-IC-CPU-00008-1: ARM® Cortex®-M7 STM32H7 Microcontroller IC 32-Bit 480MHz 2MB (2M x 8) FLASH 100-LQFP (14x14); Max Supply Voltage: 3.6V; RAM Size: 1MB; Number of I/Os: 82; Interface: I2C,SPI,USB,CAN,SDIO,USART; Min Supply Voltage: 1.71V; Core Architecture: ARM; Max Frequency: 400MHz; Data Bus Width: 32b; Number of ADC Channels: 20; Case/Package: LQFP; Min Operating Temperature: -40°C; Memory Type: FLASH; Memory Size: 2MB; Max Operating Temperature: 85°C; ComponentLink1URL: https://www.st.com/content/ccc/resource/technical/document/datasheet/group3/01/21/00/39/12/c9/4c/f1/DM00388325/files/DM00388325.pdf/jcr:content/translations/en.DM00388325.pdf; ComponentLink2Description: Reference Manual; ComponentLink1Description: Datasheet; ComponentLink3Description: Errata; ComponentLink3URL: https://www.st.com/resource/en/errata_sheet/dm00399555-stm32h750xb-and-stm32h753xi-device-limitations-stmicroelectronics.pdf; ComponentLink2URL: https://www.st.com/resource/en/reference_manual/dm00314099-stm32h742-stm32h743-753-and-stm32h750-value-line-advanced-arm-based-32-bit-mcus-stmicroelectronics.pdf; Package Quantity: 540
U3 = CMP-PMIC-00024-1: Supervisor 2.7V Open Drain 1 Channel SOT-23-5; ComponentLink1URL: https://www.ti.com/general/docs/suppproductinfo.tsp?distId=10&gotoUrl=http%253A%252F%252Fwww.ti.com%252Flit%252Fgpn%252Ftps3840; ComponentLink1Description: Datasheet
X2 = CMP-003-00030-6: 8MHz Ceramic Resonator Built in Capacitor 33pF ±0.2% 40 Ohms -40°C ~ 85°C Surface Mount; Frequency Tolerance: 0.5%; Impedance: 40R; ComponentLink1Description: Datasheet; Max Operating Temperature: 85°C; Packaging: Tape and Reel; Capacitance: 33pF; Mount: Surface Mount; Composition: Ceramic; Min Operating Temperature: -40°C; Frequency Stability: 0.2%; Case/Package: SMD/SMT; ComponentLink1URL: https://www.murata.com/en/products/productdata/8801161740318/SPEC-CSTNE8M00G550000R0.pdf?src-supplier=Digi-Key

## Sheet LCD-Memory.SchDoc
size B; DocumentNumber: 5; SheetNumber: 5; SheetTotal: 7; ENG_APP_DATE: --/--/--; DSN_APP_DATE: --/--/--; CHK_APP_DATE: --/--/--
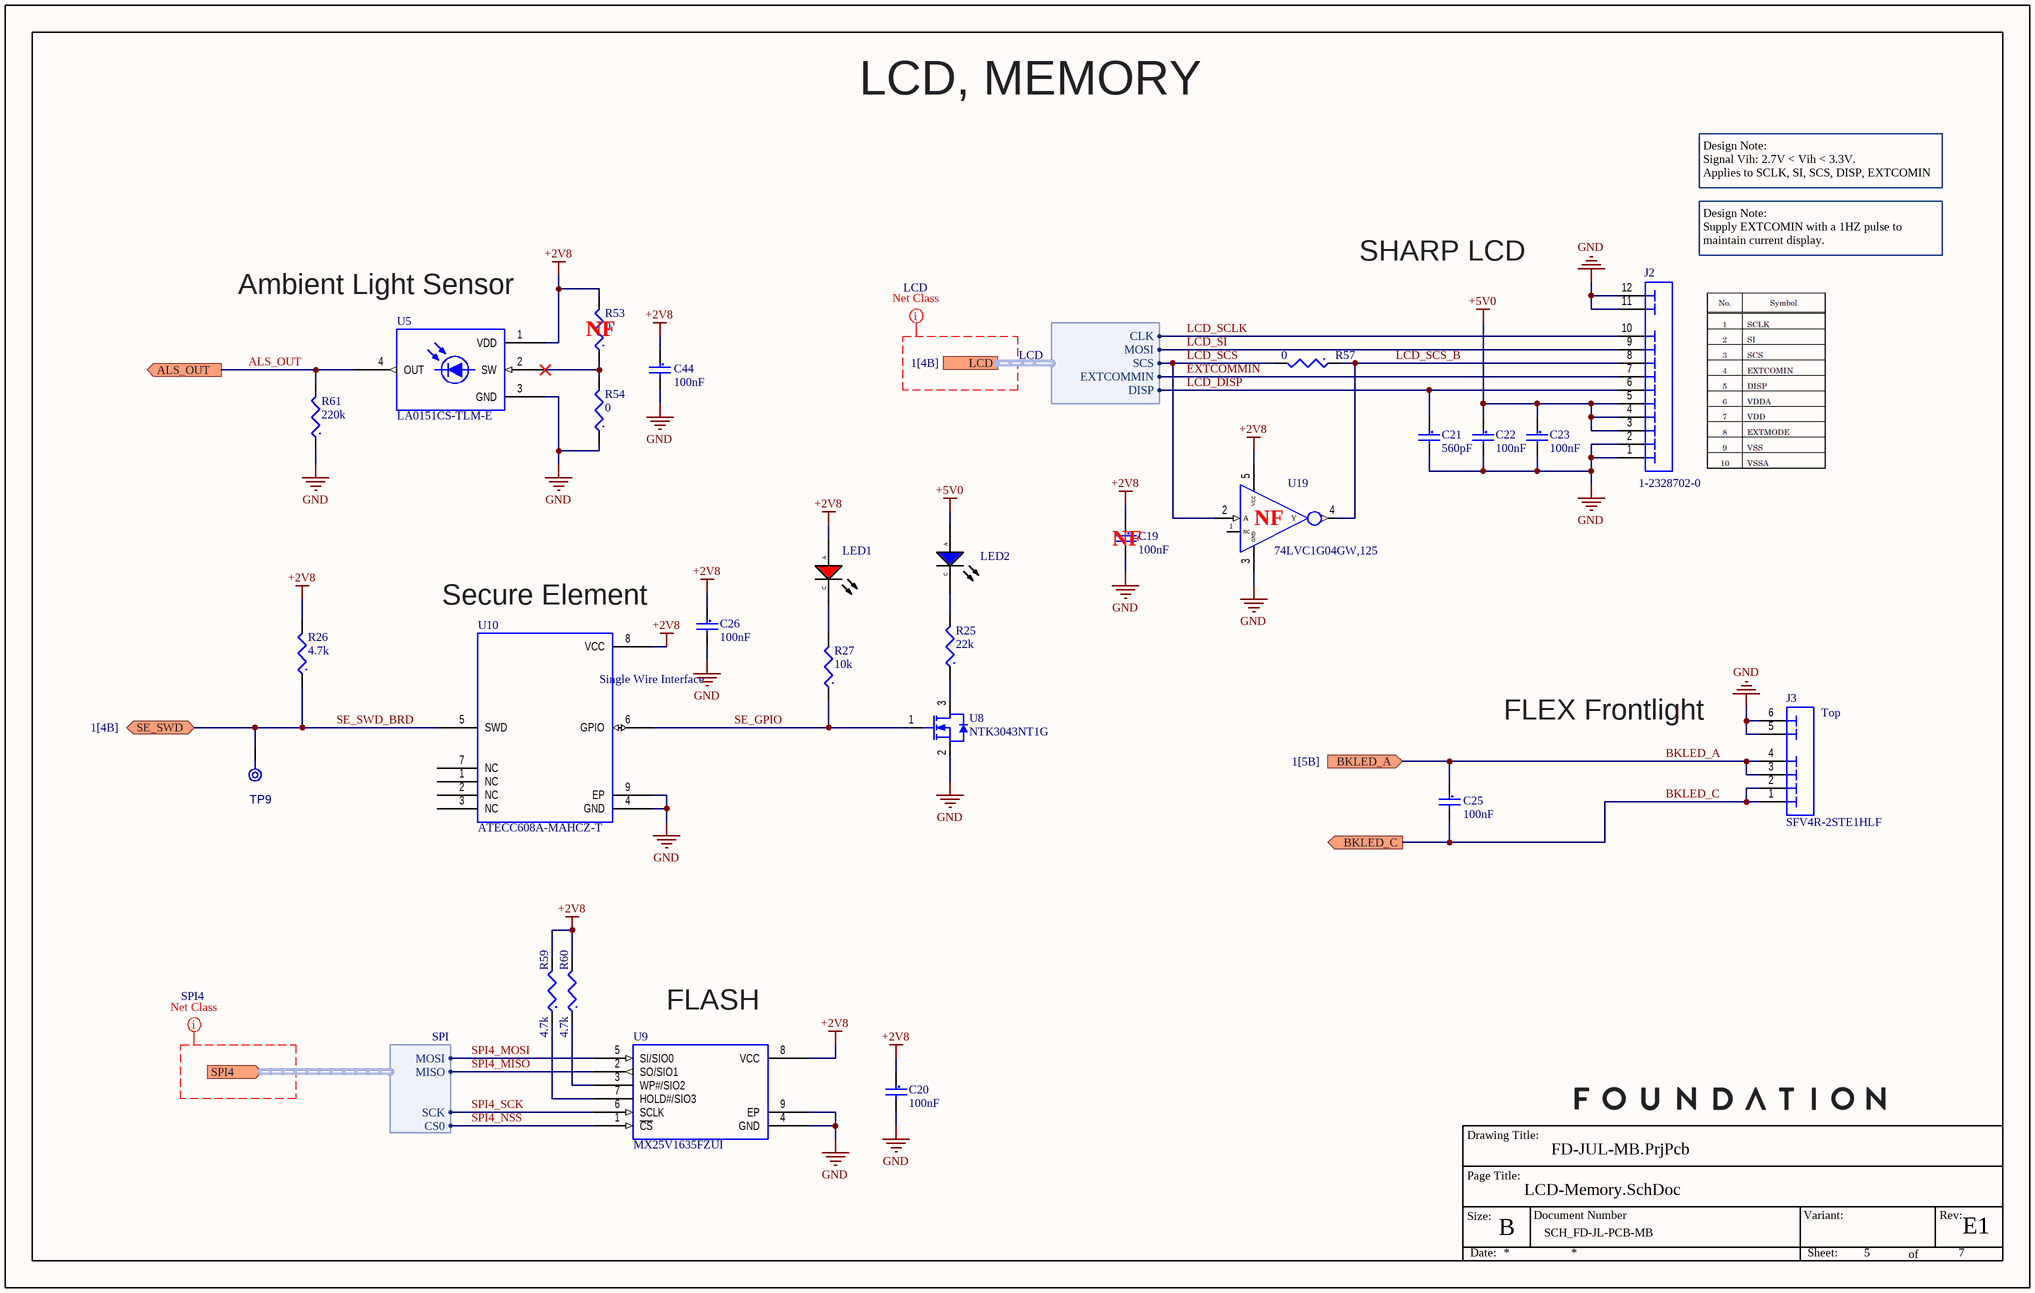
[diagram p2: LCD-Memory.SchDoc]

### Parts
C19  Capacitance: 100nF  [CAPC0402(1005)55_L]  (hidden comment: CAP CER 0.1uF 16V 10% X7R 0402)
C20  Capacitance: 100nF  [CAPC0402(1005)55_L]  (hidden comment: CAP CER 0.1uF 16V 10% X7R 0402)
C21  Capacitance: 560pF  [CAPC0402(1005)55_L]  (hidden comment: CAP CER 560pF 50V 10% X7R 0402)
C22  Capacitance: 100nF  [CAPC0402(1005)55_L]  (hidden comment: CAP CER 0.1uF 16V 10% X7R 0402)
C23  Capacitance: 100nF  [CAPC0402(1005)55_L]  (hidden comment: CAP CER 0.1uF 16V 10% X7R 0402)
C25  Capacitance: 100nF  [CAPC0402(1005)55_L]  (hidden comment: CAP CER 0.1uF 16V 10% X7R 0402)
C26  Capacitance: 100nF  [CAPC0402(1005)55_L]  (hidden comment: CAP CER 0.1uF 16V 10% X7R 0402)
C44  Capacitance: 100nF  [CAPC0402(1005)55_L]  (hidden comment: CAP CER 0.1uF 16V 10% X7R 0402)
J2  1-2328702-0  [TE - 1-2328702-0_V]
J3  SFV4R-2STE1HLF  Contact Location: Top  [AMPH - SFV4R-2STBE1HLF]
LED1  LTST-C191KRKT  [LEDC0603(1608)65_L]  (value not drawn)
LED2  KB DELPS2.DI-THVG-2J8L-Z555  [LEDC0603(1608)65_L]  (value not drawn)
R25  Resistance: 22k  [RESC0402(1005)_L]  (hidden comment: RES 22K 1/16W 1% 0402)
R26  Resistance: 4.7k  [RESC0402(1005)_L]  (hidden comment: RES 4.7K 1/16W 1% 0402)
R27  Resistance: 10k  [RESC0402(1005)_L]  (hidden comment: RES 10K 1/16W 1% 0402)
R53  Resistance: 0  [RESC0402(1005)_L]  (hidden comment: RES 0 OHM JUMPER 1/16W 0402)
R54  Resistance: 0  [RESC0402(1005)_L]  (hidden comment: RES 0 OHM JUMPER 1/16W 0402)
R57  Resistance: 0  [RESC0402(1005)_L]  (hidden comment: RES 0 OHM JUMPER 1/16W 0402)
R59  Resistance: 4.7k  [RESC0402(1005)_L]  (hidden comment: RES 4.7K 1/16W 1% 0402)
R60  Resistance: 4.7k  [RESC0402(1005)_L]  (hidden comment: RES 4.7K 1/16W 1% 0402)
R61  Resistance: 220k  [RESC0402(1005)_L]  (hidden comment: RES 220K 1/16W 1% 0402)
TP9  TPAD8R  [TP08R]  (value not drawn)  (no BOM)
U5  LA0151CS-TLM-E  [ON - ODCSP-4_V]
U8  NTK3043NT1G  [SOT-723-3(40)_N]
U9  MX25V1635FZUI  [MXIC - USON-8_V]
U10  ATECC608A-MAHCZ-T  [MCHP - UDFN-8_L]
U19  74LVC1G04GW,125  [NEXP - TSSOP-5_L]

### Ports
ALS_OUT (out), BKLED_A (in, see 1[5B]), BKLED_C (out), LCD (harness LCD, see 1[4B]), SE_SWD (bidir, see 1[4B]), SPI4 (in, harness SPI)

### Harnesses
LCD: CLK, SCS, MOSI, DISP, EXTCOMMIN
SPI: CS0, MISO, MOSI, SCK

### Nets
+2V8: C19.1 C20.1 C26.1 C44.1 LED1.A R26.2 R53.2 R59.2 R60.2 U5.1(VDD) U9.8(VCC) U10.8(VCC) U19.5(VCC)
+5V0: C22.1 C23.1 J2.3 J2.4 J2.5 LED2.A
GND: C19.2 C20.2 C21.2 C22.2 C23.2 C26.2 C44.2 J2.1 J2.2 J2.11 J2.12 J3.5 J3.6 R54.1 R61.1 U5.3(GND) U8.2(S) U9.4(GND) U9.9(EP) U10.4(GND) U10.9(EP) U19.3(GND)
ALS_OUT: R61.2 U5.4(OUT) ; port ALS_OUT
BKLED_A: C25.1 J3.3 J3.4 ; port BKLED_A
BKLED_C: C25.2 J3.1 J3.2 ; port BKLED_C
EXTCOMMIN: J2.7 ; port LCD.EXTCOMMIN
LCD_DISP: C21.1 J2.6 ; port LCD.DISP
LCD_SCLK: J2.10 ; port LCD.CLK
LCD_SCS: R57.2 U19.2(A) ; port LCD.SCS
LCD_SCS_B: J2.8 R57.1 U19.4(Y)
LCD_SI: J2.9 ; port LCD.MOSI
SE_GPIO: R27.1 U8.1(G) U10.6(GPIO)
SE_SWD_BRD: R26.1 TP9.1(TP) U10.5(SWD) ; port SE_SWD  [project net SE_SWD]
SPI4_MISO: U9.2(SO/SIO1) ; port SPI4.MISO
SPI4_MOSI: U9.5(SI/SIO0) ; port SPI4.MOSI
SPI4_NSS: U9.1(~{CS}) ; port SPI4.CS0
SPI4_SCK: U9.6(SCLK) ; port SPI4.SCK
NetLED1_C: LED1.C R27.2
NetLED2_C: LED2.C R25.2
NetR25_1: R25.1 U8.3(D)
NetR53_1: R53.1 R54.2 U5.2(SW)
NetR59_1: R59.1 U9.7(HOLD#/SIO3)
NetR60_1: R60.1 U9.3(WP#/SIO2)

Not connected (* = marked no-connect by the designer): U10 1(NC) 2(NC) 3(NC) 7(NC); U19 1(NC)

### Layout directives
net class LCD: (no net found under the mark)
net class SPI4: (no net found under the mark)

### Notes on the sheet
- LCD, MEMORY
- Design Note:
  Signal Vih: 2.7V < Vih < 3.3V.
  Applies to SCLK, SI, SCS, DISP, EXTCOMIN
- (near U5) Ambient Light Sensor
- SHARP LCD
- Design Note:
  Supply EXTCOMIN with a 1HZ pulse to maintain current display.
- (near U10) Secure Element
- FLEX Frontlight
- (near U9) FLASH
- Drawing Title:
- Page Title:
- Size:
- B
- Document Number
- Variant:
- Rev:
- Date:
- Sheet:
- of
- (in symbol CMP-IC-MEM-0002-6) Single Wire Interface

### Library data of the parts
C19 C20 C22 C23 C25 C26 C44 = CMP-CAP-00002-2: as C1 on sheet STM32H753; Material: Ceramic; Tolerance: 10%; REACH SVHC: No SVHC; Radiation Hardening: No; Case Code (Metric): 1005; Height: 0.5mm; Depth: 0.5mm; Min Operating Temperature: -55°C; Max Operating Temperature: 125°C; Lead Free: Lead Free; Thickness: 0.022inch; Length: 1mm; Voltage Rating (DC): 16V; Dielectric Material: Ceramic; Packaging: Tape and Reel; Case/Package: 0402; Width: 0.5mm; Termination: SMD/SMT; Voltage Rating: 16V; Mount: Surface Mount; Case Code (Imperial): 0402; Package Quantity: 1; Dielectric: X7R; Number of Pins: 2; Voltage: 16V
C21 = CMP-CAP-00005-1: 560pF ±10% 50V Ceramic Capacitor X7R 0402 (1005 Metric); Case/Package: 0402; Material: Ceramic; Thickness: 0.022inch; Tolerance: 10%; Min Operating Temperature: -55°C; Lead Free: Lead Free; Radiation Hardening: No; Dielectric: X7R; Voltage Rating (DC): 50V; Max Operating Temperature: 125°C; Depth: 0.5mm; Termination: SMD/SMT; Width: 0.5mm; Voltage: 50V; Voltage Rating: 50V; Case Code (Imperial): 0402; Packaging: Tape and Reel; Case Code (Metric): 1005; Mount: Surface Mount; Height: 0.5mm; Length: 1mm; Package Quantity: 1
J2 = CMP-CON-0035-1: 10 Position FPC Connector Contacts, Top and Bottom 0.020" (0.50mm) Surface Mount, Right Angle; Min Operating Temperature: -55°C; ComponentLink1Description: Datasheet; Max Operating Temperature: 85°C; ComponentLink1URL: https://www.te.com/commerce/DocumentDelivery/DDEController?Action=srchrtrv&DocNm=2328702&DocType=Customer+Drawing&DocLang=English
J3 = CMP-CON-0036-3: 4 Position FFC, FPC Connector Contacts, Top 0.020" (0.50mm) Surface Mount, Right Angle; Actuator Material: Glass,Polyphenylene; Insulation Resistance: 100MR; Number of Positions: 4; Wire/Cable Type: Straight; Pitch: 0.5mm; Voltage Rating: 50V; Current Rating: 500mA; Contact Resistance: 30mR; Number of Rows: 1; Contact Plating: Tin; Max Operating Temperature: 105°C; Termination: Solder; Orientation: Right Angle; Contact Material: Bronze; Housing Material: Polyamide; Packaging: Tape and Reel; Flammability Rating: UL94 V-0; Mount: Surface Mount; Package Quantity: 3000; Min Operating Temperature: -55°C; Max Voltage Rating (AC): 50V; Number of Contacts: 4; Depth: 4.9mm; Max Voltage Rating (DC): 50V; Radiation Hardening: No; Lead Free: Lead Free; Length: 7.5mm; Housing Color: Black
LED1 = CMP-007-00039-8: Red 631nm LED Indication - Discrete 2V 0603 (1608 Metric); Viewing Angle: 130°; Test Current: 20mA; Number of LEDs: 1; Reverse Voltage: 5V; Power Rating: 75mW; Luminous Intensity: 54mcd; Lens Color: Colorless; Lens Style: Clear,Diffused,Colorless,Rectangular; Lens Transparency: Clear; Wavelength: 639nm; Forward Current: 30mA; Case/Package: 0603; Lead Free: Lead Free; Dominant Wavelength: 631nm; Forward Voltage: 2V; Depth: 0.8mm; Length: 1.6mm; Height: 0.55mm; Power Dissipation: 75mW; Voltage: 2V; Width: 0.8mm; Mount: Surface Mount; Illumination Color: Red; Case Code (Metric): 1608; Case Code (Imperial): 0603; Number of Pins: 2; Packaging: Tape and Reel; Max Operating Temperature: 85°C; Min Operating Temperature: -55°C; Radiation Hardening: No; Color: Red; Package Quantity: 1; Number of Elements: 1
LED2 = CMP-007-00045-4: Blue 466nm LED Indication - Discrete 2.8V 2-SMD 0603
R25 = CMP-RES-00040-1: 22 kOhms ±1% 0.063W, 1/16W Chip Resistor 0402 (1005 Metric); Voltage Rating: 50V; Max Power Dissipation: 63mW; Temperature Coefficient: 100ppm/°C; Max Operating Temperature: 155°C; Case/Package: 0402; Min Operating Temperature: -55°C; Tolerance: 1%; Depth: 0.5mm; Composition: Thick Film; Number of Terminations: 2; Features: Automotive AEC-Q200; Power Rating: 63mW; Radiation Hardening: No; Voltage Rating (DC): 50V; Termination: SMD/SMT; Lead Free: Lead Free; Width: 0.5mm; Contact Plating: Tin; Weight: 2.3E-05oz; Length: 1mm; Packaging: Tape and Reel; REACH SVHC: Unknown; Package Quantity: 10; Mount: Surface Mount; Working Voltage: 50V; Case Code (Metric): 1005; Military Standard: Not; Height: 0.35mm; Case Code (Imperial): 0402
R26 R59 R60 = CMP-RES-00002-3: 4.7 kOhms ±1% 0.063W, 1/16W Chip Resistor 0402 (1005 Metric) Automotive AEC-Q200 Thick Film; Max Power Dissipation: 63mW; Voltage Rating (DC): 50V; Temperature Coefficient: 100ppm/°C; Weight: 2.3E-05oz; Package Quantity: 10; Military Standard: Not; Contact Plating: Tin; Termination: SMD/SMT; Max Operating Temperature: 155°C; Case Code (Metric): 1005; Case Code (Imperial): 0402; Features: Automotive AEC-Q200; Power Rating: 63mW; REACH SVHC: Unknown; Min Operating Temperature: -55°C; Tolerance: 1%; Mount: Surface Mount; Width: 0.5mm; Depth: 0.5mm; Radiation Hardening: No; Length: 1mm; Number of Terminations: 2; Case/Package: 0402; Voltage Rating: 50V; Height: 0.35mm; Packaging: Tape and Reel; Lead Free: Lead Free; Composition: Thick Film
R27 = CMP-RES-00006-3: 10 kOhms ±1% 0.063W, 1/16W Chip Resistor 0402 (1005 Metric); Max Power Dissipation: 63mW; Temperature Coefficient: 100ppm/°C; Voltage Rating: 50V; Termination: SMD/SMT; Max Operating Temperature: 155°C; Height: 0.35mm; Length: 1mm; Case Code (Metric): 1005; REACH SVHC: Unknown; Case/Package: 0402; Number of Terminations: 2; Weight: 2.3E-05oz; Composition: Thick Film; Contact Plating: Tin; Min Operating Temperature: -55°C; Width: 0.02inch; Package Quantity: 10; Military Standard: Not; Case Code (Imperial): 0402; Depth: 0.5mm; Features: Automotive AEC-Q200; Packaging: Tape and Reel; Radiation Hardening: No; Lead Free: Lead Free; Power Rating: 63mW; Tolerance: 1%; Voltage Rating (DC): 50V; Number of Pins: 2; Mount: Surface Mount
R53 R54 R57 = CMP-RES-00014-4: as R9 on sheet STM32H753; Lead Free: Lead Free; Height: 0.016inch; Military Standard: Not; Max Operating Temperature: 155°C; Features: Moisture Resistant; Case/Package: 0402; Contact Plating: Tin,Matte; Composition: Thick Film; Number of Terminations: 2; Case Code (Imperial): 0402; Package Quantity: 1; REACH SVHC: Unknown; Radiation Hardening: No; Case Code (Metric): 1005; Width: 0.02inch; Termination: SMD/SMT; Min Operating Temperature: -55°C; Length: 1mm; Packaging: Tape and Reel; Depth: 0.5mm
R61 = CMP-RES-00039-1: 220 kOhms ±1% 0.063W, 1/16W Chip Resistor 0402 (1005 Metric); Power Rating: 63mW; Voltage Rating (DC): 50V; Temperature Coefficient: 100ppm/°C; Military Standard: Not; Case Code (Metric): 1005; Case Code (Imperial): 0402; Min Operating Temperature: -55°C; Length: 1mm; Weight: 2.3E-05oz; Width: 0.5mm; Number of Terminations: 2; Radiation Hardening: No; REACH SVHC: Unknown; Tolerance: 1%; Package Quantity: 10; Lead Free: Lead Free; Max Power Dissipation: 63mW; Features: Automotive AEC-Q200; Height: 0.35mm; Composition: Thick Film; Max Operating Temperature: 155°C; Contact Plating: Tin; Depth: 0.5mm; Voltage Rating: 50V; Packaging: Tape and Reel; Case/Package: 0402; Termination: SMD/SMT; Mount: Surface Mount
TP9 = CMP-MECH-00011-2: 0.8mm round; Pins: 1
U5 = CMP-SEN-0006-2: Optical Sensor Ambient 550nm Current 4-WFBGA, CSPBGA; Max Input Voltage: 5.5V; Min Input Voltage: 2.2V; Min Operating Temperature: -30°C; ComponentLink1URL: https://www.onsemi.com/pub/Collateral/LA0151CS-D.PDF; Lead Free: Lead Free; Sensing Method: Optical; Package Quantity: 5000; Height: 0.5mm; Max Operating Temperature: 85°C; Wavelength: 550nm; Number of Pins: 4; Width: 1.01mm; Max Supply Voltage: 5.5V; Packaging: Tape and Reel; Case/Package: SMD/SMT; Min Supply Voltage: 2.2V; Length: 1.01mm; ComponentLink1Description: Datasheet
U8 = CMP-TRNST-0003-1: N-Channel 20V 210mA (Ta) 310mW (Ta) Surface Mount SOT-723; Power Dissipation: 440mW; Gate to Source Voltage (Vgs): 10V; Drain to Source Resistance: 3.4R; Input Capacitance: 11pF; Turn-On Delay Time: 13ns; Vgs(th) (Max) @ Id: 1.3V @ 250µA; Turn-Off Delay Time: 94ns; Rise Time: 15ns; Number of Elements: 1; Element Configuration: Single; Current Rating: 225mA; Threshold Voltage: 400mV; Max Operating Temperature: 150°C; Package Quantity: 1; Packaging: Tape and Reel; Continuous Drain Current (ID): 210mA; Pins: 3; Min Operating Temperature: -55°C; Vgs (Max): 10V; Drain to Source Breakdown Voltage: 20V; Radiation Hardening: No; Mounting Technology: Surface Mount; Drain to Source Voltage (Vdss): 20V; Number of Pins: 3; Max Power Dissipation: 310mW; Fall Time: 15ns; Case/Package: SOT-723-3; Transistor Type: N-Channel; Rds On Max: 3.4R; Lead Free: Lead Free; Height: 0.55mm; Contact Plating: Tin,Matte; On-State Resistance: 3.4R; Length: 1.25mm; REACH SVHC: No SVHC; Width: 0.85mm; Voltage Rating (DC): 20V
U9 = CMP-IC-MEM-0015-3: FLASH - NOR Memory IC 16Mb (2M x 8) SPI - Quad I/O 80MHz  8-USON (2x3); ComponentLink1URL: https://www.macronix.com/Lists/Datasheet/Attachments/7409/MX25V1635F,%202.5V,%2016Mb,%20v1.4.pdf; ComponentLink1Description: Datasheet
U10 = CMP-IC-MEM-0002-6: Cryptographic Co-Processor with Secure Hardware-Based Key Storage 1-Wire Interface 8-Pin UDFN T/R; Case/Package: 8-UDFN (2x3)
U19 = CMP-IC-LOG-0005-2: Inverter IC 1 Channel  5-TSSOP; Min Supply Voltage: 1.65V; Max Supply Voltage: 5.5V; Output Function: Y=~A; Max Operating Temperature: 125°C; ComponentLink1Description: Datasheet; RoHS Compliant: ROHS3 Compliant; Min Operating Temperature: -40°C; Pins: 1; ComponentLink1URL: https://assets.nexperia.com/documents/data-sheet/74LVC1G04.pdf; Case/Package: 5-TSSOP; Logic Type: Inverter